# Altium schematic sheet NodeFPGA.SchDoc: NodeFPGA
size A3; Author: hfegetude; SheetNumber: 1; SheetTotal: 1; Time: 1
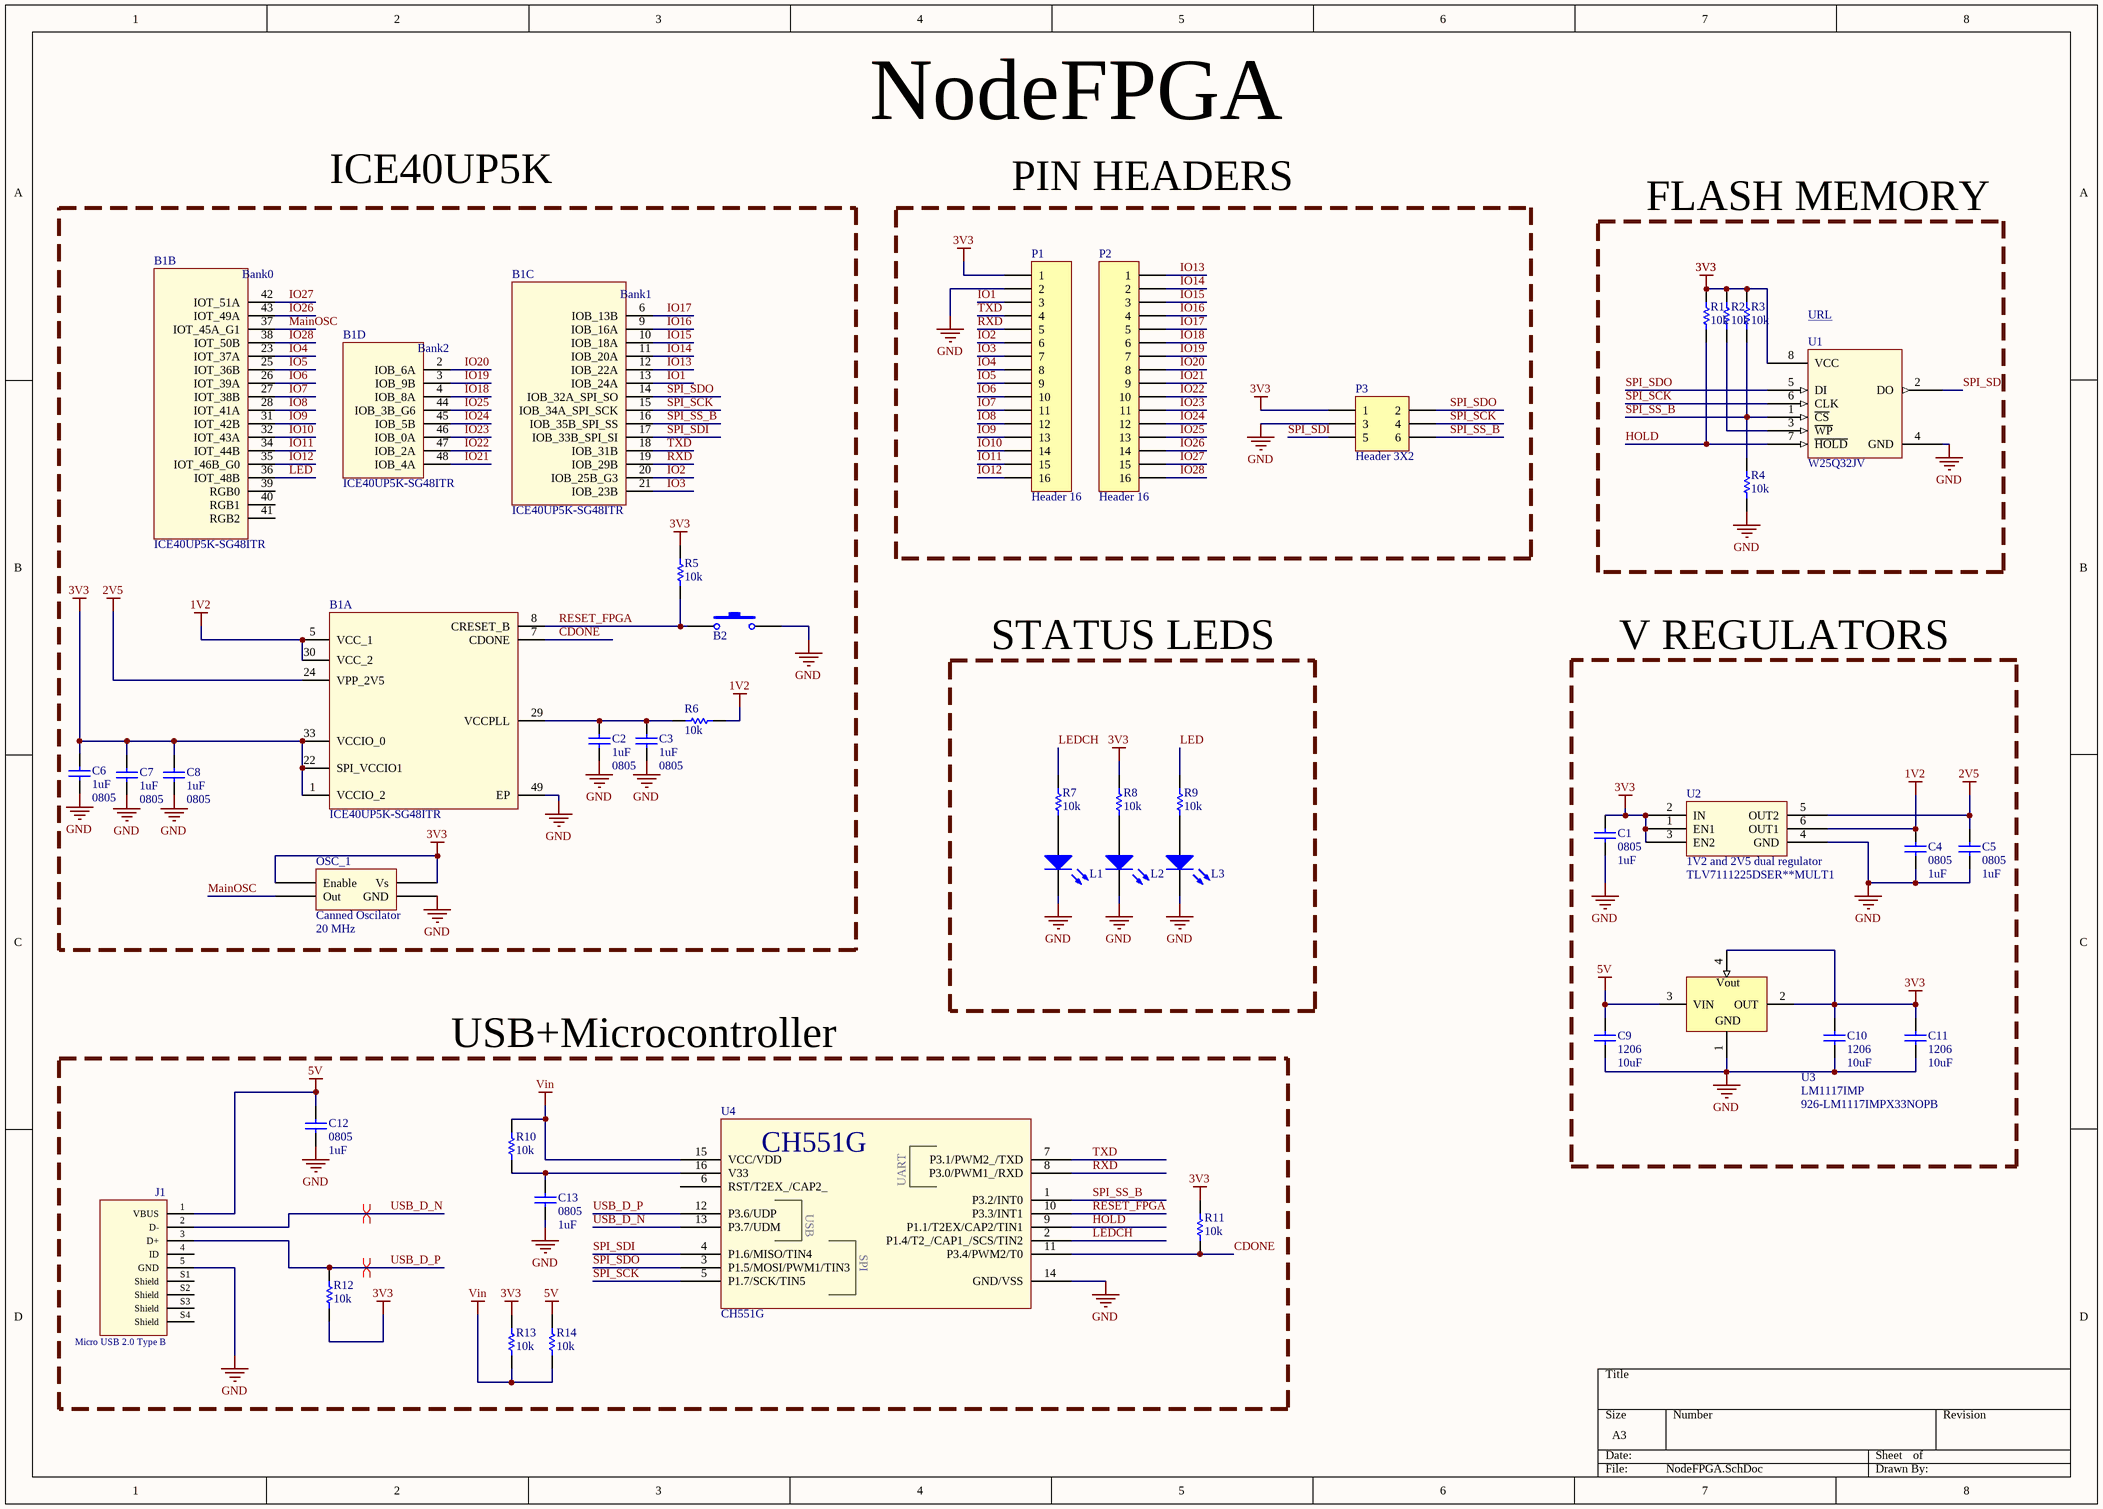
[diagram p0: NodeFPGA.SchDoc]

## Parts
B1  ICE40UP5K-SG48ITR  [QFN50P700X700X100-49N-D]  (parts A,B,C,D of 4)
B2  FSM6JH  [SMD_PUSHBUTTON_3x6x2mm5]  (value not drawn)
C1  0805  value 1uF  [0805]
C2  value 1uF  [0805]  (hidden comment: 0805)
C3  value 1uF  [0805]  (hidden comment: 0805)
C4  0805  value 1uF  [0805]
C5  0805  value 1uF  [0805]
C6  value 1uF  [0805]  (hidden comment: 0805)
C7  value 1uF  [0805]  (hidden comment: 0805)
C8  value 1uF  [0805]  (hidden comment: 0805)
C9  1206  value 10uF  [0805]
C10  1206  value 10uF  [0805]
C11  1206  value 10uF  [0805]
C12  0805  value 1uF  [0805]
C13  0805  value 1uF  [0805]
J1  Micro USB 2.0 Type B  [629105136821]
L1  LED_SMD  [0805]  (value not drawn)
L2  LED_SMD  [0805]  (value not drawn)
L3  LED_SMD  [0805]  (value not drawn)
OSC_1  Canned Oscilator  value 20 MHz  [Canned Oscilator]
P1  Header 16  [HDR1X16]
P2  Header 16  [HDR1X16]
P3  Header 3X2  [HDR2X3]
R1  value 10k  [Resistencia 0603]  (hidden comment: Resistor)
R2  value 10k  [Resistencia 0603]  (hidden comment: Resistor)
R3  value 10k  [Resistencia 0603]  (hidden comment: Resistor)
R4  value 10k  [Resistencia 0603]  (hidden comment: Resistor)
R5  value 10k  [Resistencia 0603]  (hidden comment: Resistor)
R6  value 10k  [Resistencia 0603]  (hidden comment: Resistor)
R7  value 10k  [Resistencia 0603]  (hidden comment: Resistor)
R8  value 10k  [Resistencia 0603]  (hidden comment: Resistor)
R9  value 10k  [Resistencia 0603]  (hidden comment: Resistor)
R10  value 10k  [Resistencia 0603]  (hidden comment: Resistor)
R11  value 10k  [Resistencia 0603]  (hidden comment: Resistor)
R12  value 10k  [Resistencia 0603]  (hidden comment: Resistor)
R13  value 10k  [Resistencia 0603]  (hidden comment: Resistor)
R14  value 10k  [Resistencia 0603]  (hidden comment: Resistor)
U1  W25Q32JV  [W25Q32]
U2  1V2 and 2V5 dual regulator  Supplier Part Number 1: TLV7111225DSER**MULT1  [DSE 6]
U3  LM1117IMP  Supplier Part Number 1: 926-LM1117IMPX33NOPB  [SOT-223]
U4  CH551G  [CH551]

## Blocks framed on the sheet
ICE40UP5K: B1 B2 C2 C3 C6-C8 OSC_1 R5 R6
PIN HEADERS: P1-P3
FLASH MEMORY: R1-R4 U1
STATUS LEDS: L1-L3 R7-R9
V REGULATORS: C1 C4 C5 C9-C11 U2 U3
USB+Microcontroller: C12 C13 J1 R10-R14 U4

## Nets
1V2: B1.5(VCC_1) B1.30(VCC_2) C4.1 R6.2 U2.6(OUT1)
2V5: B1.24(VPP_2V5) C5.1 U2.5(OUT2)
3V3: B1.1(VCCIO_2) B1.22(SPI_VCCIO1) B1.33(VCCIO_0) C1.1 C6.2 C7.2 C8.2 C10.1 C11.1 OSC_1.1(Enable) OSC_1.4(Vs) P1.1 P3.1 R1.2 R2.2 R3.2 R5.2 R8.2 R11.2 R12.2 R13.1 U1.8(VCC) U2.1(EN1) U2.2(IN) U2.3(EN2) U3.2(OUT) U3.4(Vout)
5V: C9.1 C12.1 J1.1(VBUS) R14.2 U3.3(VIN)
GND: B1.49(EP) B2.2 C1.2 C2.1 C3.1 C4.2 C5.2 C6.1 C7.1 C8.1 C9.2 C10.2 C11.2 C12.2 C13.2 J1.5(GND) L1.2(K) L2.2(K) L3.2(K) OSC_1.2(GND) P1.2 P3.3 R4.1 U1.4(GND) U2.4(GND) U3.1(GND) U4.14(GND/VSS)
Vin: R10.1 R13.2 R14.1 U4.15(VCC/VDD)
CDONE: B1.7(CDONE) R11.1 U4.11(P3.4/PWM2/T0)
HOLD: R1.1 U1.7(~{HOLD}) U4.9(P1.1/T2EX/CAP2/TIN1)
IO1: B1.13(IOB_24A) P1.3
IO2: B1.20(IOB_25B_G3) P1.6
IO3: B1.21(IOB_23B) P1.7
IO4: B1.23(IOT_37A) P1.8
IO5: B1.25(IOT_36B) P1.9
IO6: B1.26(IOT_39A) P1.10
IO7: B1.27(IOT_38B) P1.11
IO8: B1.28(IOT_41A) P1.12
IO9: B1.31(IOT_42B) P1.13
IO10: B1.32(IOT_43A) P1.14
IO11: B1.34(IOT_44B) P1.15
IO12: B1.35(IOT_46B_G0) P1.16
IO13: B1.12(IOB_22A) P2.1
IO14: B1.11(IOB_20A) P2.2
IO15: B1.10(IOB_18A) P2.3
IO16: B1.9(IOB_16A) P2.4
IO17: B1.6(IOB_13B) P2.5
IO18: B1.4(IOB_8A) P2.6
IO19: B1.3(IOB_9B) P2.7
IO20: B1.2(IOB_6A) P2.8
IO21: B1.48(IOB_4A) P2.9
IO22: B1.47(IOB_2A) P2.10
IO23: B1.46(IOB_0A) P2.11
IO24: B1.45(IOB_5B) P2.12
IO25: B1.44(IOB_3B_G6) P2.13
IO26: B1.43(IOT_49A) P2.14
IO27: B1.42(IOT_51A) P2.15
IO28: B1.38(IOT_50B) P2.16
LED: B1.36(IOT_48B) R9.2
LEDCH: R7.2 U4.2(P1.4/T2_/CAP1_/SCS/TIN2)
MainOSC: B1.37(IOT_45A_G1) OSC_1.3(Out)
RESET_FPGA: B1.8(CRESET_B) B2.1 R5.1 U4.10(P3.3/INT1)
RXD: B1.19(IOB_29B) P1.5 U4.8(P3.0/PWM1_/RXD)
SPI_SCK: B1.15(IOB_34A_SPI_SCK) P3.4 U1.6(CLK) U4.5(P1.7/SCK/TIN5)
SPI_SDI: B1.17(IOB_33B_SPI_SI) P3.5 U1.2(DO) U4.4(P1.6/MISO/TIN4)
SPI_SDO: B1.14(IOB_32A_SPI_SO) P3.2 U1.5(DI) U4.3(P1.5/MOSI/PWM1/TIN3)
SPI_SS_B: B1.16(IOB_35B_SPI_SS) P3.6 R3.1 R4.2 U1.1(~{CS}) U4.1(P3.2/INT0)
TXD: B1.18(IOB_31B) P1.4 U4.7(P3.1/PWM2_/TXD)
USB_D_N: J1.2(D-) U4.13(P3.7/UDM)
USB_D_P: J1.3(D+) R12.1 U4.12(P3.6/UDP)
NetB1_29: B1.29(VCCPLL) C2.2 C3.2 R6.1
NetC13_1: C13.1 R10.2 U4.16(V33)
NetL1_1: L1.1(A) R7.1
NetL2_1: L2.1(A) R8.1
NetL3_1: L3.1(A) R9.1
NetR2_1: R2.1 U1.3(~{WP})

Not connected (* = marked no-connect by the designer): B1 39(RGB0) 40(RGB1) 41(RGB2); J1 4(ID) S1(Shield) S2(Shield) S3(Shield) S4(Shield); U4 6(RST/T2EX_/CAP2_)

## Layout directives
differential pair: USB_D_N, USB_D_P

## Notes on the sheet
- NodeFPGA
- URL <https://eu.mouser.com/ProductDetail/STMicroelectronics/M95M02-DWMN3TP-K?qs=sGAEpiMZZMuVhdAcoizlRYly6JnwLZjJGi2czB2d%252bG8%3d>
- (in symbol CH551G) UART; USB; SPI
- (in symbol ICE40UP5K-SG48ITR, part B) Bank0
- (in symbol ICE40UP5K-SG48ITR, part C) Bank1
- (in symbol ICE40UP5K-SG48ITR, part D) Bank2

## Library data of the parts
B1 = ICE40UP5K-SG48ITR: FPGA - Field Programmable Gate Array iCE40-UltraPlus, 5280 LUTs, 1.2V; Manufacturer_Name: Lattice; Geometry.Height: 1mm; Mouser Part Number: 842-40UP5KSG48ITR; Manufacturer_Part_Number: ICE40UP5K-SG48ITR; Datasheet Link: https://componentsearchengine.com/Datasheets/1/ICE40UP5K-SG48ITR.pdf
B2 = FSM6JH: Button THT Switch; Supplier 1: Mouser; Supplier Part Number 1: 506-FSM6JH
C1 C4 C5 C12 C13 = Capacitor_0805: Capacitor; Supplier 1: Mouser; Supplier Part Number 1: 80-C1206C104K5R
C2 C3 C6-C8 = Capacitor: Supplier 1: Mouser; Supplier Part Number 1: 80-C1206C104K5R; Package: 0805
C9-C11 = Capacitor_1206: Capacitor; Supplier 1: Mouser; Supplier Part Number 1: 80-C1206C104K5R
J1 = 629105136821: Micro USB 2.0 Type B Horizontal SMT 5 Contacts WR-COM; Rated Current: 1 A; Gender: Female; ComponentLink1Description: Manufacturer; ComponentLink1URL: http://www.we-online.de; ComponentLink2Description: Datasheet; ComponentLink2URL: http://katalog.we-online.de/em/datasheet/629105136821.pdf; Part Number: 629105136821; Published Date: May 2018; Publisher: Wurth Elektronik; Orientation: Horizontal; Interface Type: Micro USB 2.0 Type B; Operating Temperature: -40 to 85 degC; Mounting Technology: SMT; Packaging: Tape and Reel
L1-L3 = LED_SMD: LED SMD; Supplier 1: Mouser; Supplier Part Number 1: 630-HSMC-C170
OSC_1 = Canned Oscilator: Canned Oscilator -LFSPXO019116BULK; ManualRef: 449-LFSPXO019116BULK
P1 P2 = Header 16: Header, 16-Pin; LatestRevisionDate: 17-Jul-2002; LatestRevisionNote: Re-released for DXP Platform.; Publisher: Altium Limited
P3 = Header 3X2: Header, 3-Pin, Dual row; LatestRevisionDate: 17-Jul-2002; LatestRevisionNote: Re-released for DXP Platform.; Publisher: Altium Limited
U1 = W25Q32JV: 32M-BIT SERIAL FLASH MEMORY WITH DUAL AND QUAD SPI
U2 = TLV7111225DSER: Supplier 1: Arrow
U3 = LM1117IMP: 5V to 3.3V 800mA Low-Dropout Linear Regulator; Supplier 1: Mouser
U4 = CH551G: Microcontroller wUSB support; ComponentLink1Description: LCSC; ComponentLink1URL: https://lcsc.com/product-detail/USB_CH551G_C108958.html
R1-R14 = Resistor: Supplier 1: Farnell; Supplier Part Number 1: 2358436